# EAGLE design AQS (EAGLE 9.6.2)

## Sheet 1 of 2
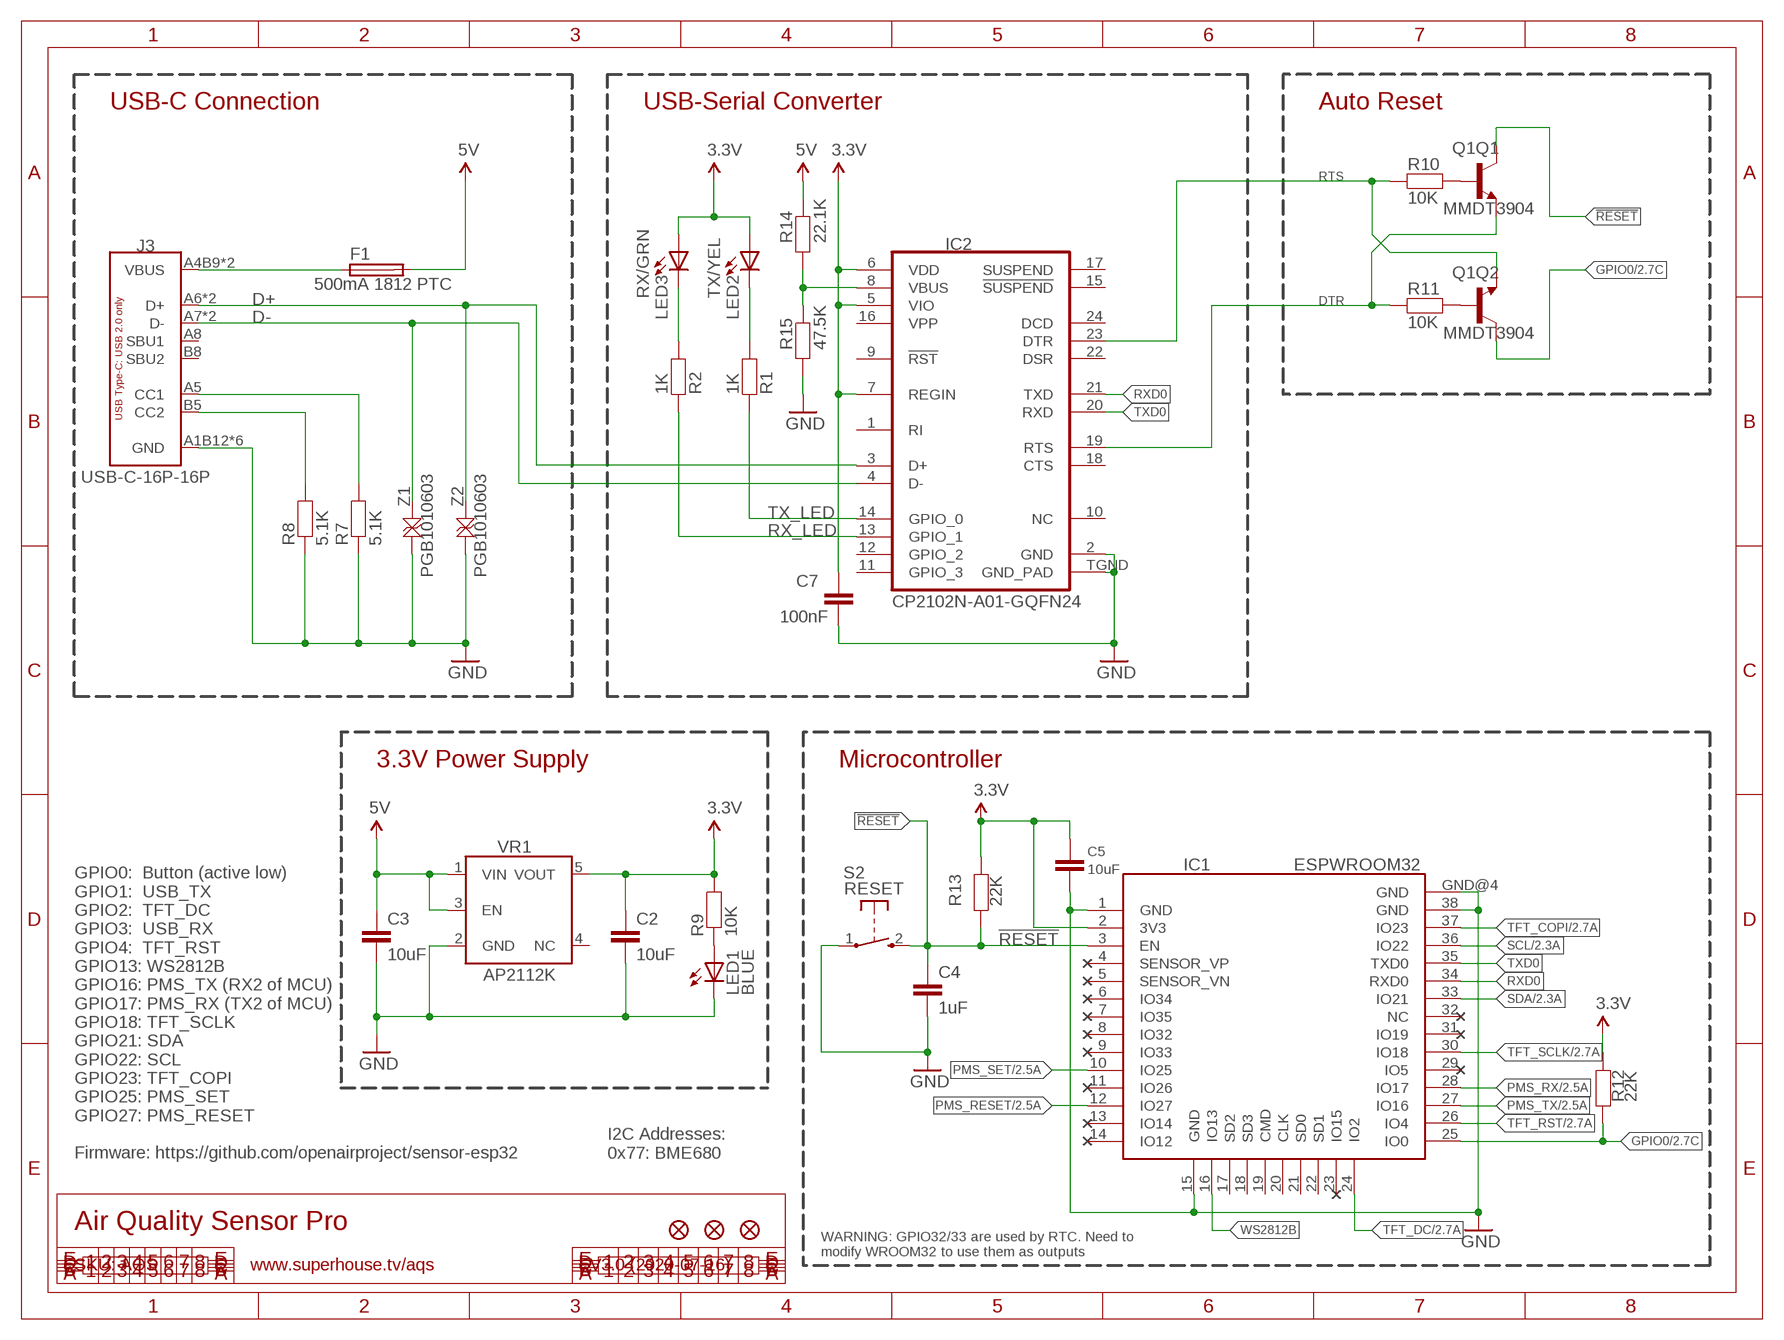
[diagram p0: schematic, sheet 1]

### Parts
C2  10uF  CAP0805  [C0805]
C3  10uF  CAP0805  [C0805]
C4  1uF  CAP0603  [C0603]
C5  10uF  CAP0805  [C0805]
C7  100nF  CAP0603  [C0603]
F1  500mA 1812 PTC  PTC050  [1812]
IC1  ESPWROOM32  [ESPWROOM32]
IC2  CP2102N-A01-GQFN24  CP2104  [QFN-24]
J3  USB-C-16P-16P  [USB-C-16P]
LED1  BLUE  LED0603  [LED-0603]
LED2  TX/YEL  LED0603  [LED-0603]
LED3  RX/GRN  LED0603  [LED-0603]
Q1  MMDT3904  TRANS_NPN_DUAL-MMDT3904  [SOT-363]
R1  1K  RESISTOR0603  [R0603]
R2  1K  RESISTOR0603  [R0603]
R7  5.1K  RESISTOR0603  [R0603]
R8  5.1K  RESISTOR0603  [R0603]
R9  10K  RESISTOR0603  [R0603]
R10  10K  RESISTOR0603  [R0603]
R11  10K  RESISTOR0603  [R0603]
R12  22K  RESISTOR0603  [R0603]
R13  22K  RESISTOR0603  [R0603]
R14  22.1K  RESISTOR0603  [R0603]
R15  47.5K  RESISTOR0603  [R0603]
S2  RESET  TAC_SWITCH_2PINSMT  [TACTILE_SMT_3X4X2]
U$23  FIDUCIAL1X2  [FIDUCIAL-1X2]
U$24  FIDUCIAL1X2  [FIDUCIAL-1X2]
U$25  FIDUCIAL1X2  [FIDUCIAL-1X2]
VR1  AP2112KSOT25  [SOT23-5]
Z1  PGB1010603  TVS0603  [TVS0603]
Z2  PGB1010603  TVS0603  [TVS0603]

### Nets
3.3V: C2.1 C5.1 C7.1 IC1.2(3V3) IC2.5(VIO) IC2.6(VDD) IC2.7(REGIN) LED2.A LED3.A R9.2 R12.1 R13.1 VR1.5(VOUT) ; also sheet 2
5V: C3.1 F1.2 R14.2 VR1.1(VIN) VR1.3(EN) ; also sheet 2
!RESET: C4.1 IC1.3(EN) Q1.3(Q1:C) R13.2 S2.2(S)
D+: IC2.3(D+) J3.A6(D+) J3.B6(D+) Z2.2
D-: IC2.4(D-) J3.A7(D-) J3.B7(D-) Z1.2
DTR: IC2.23(DTR) Q1.1(Q2:E) R10.1
GND: C2.2 C3.2 C4.2 C5.2 C7.2 IC1.1(GND) IC1.15(GND) IC1.38(GND) IC1.GND@4(GND) IC2.2(GND) IC2.TGND(GND_PAD) J3.A1B12(GND) J3.A12B1(GND) J3.FIX1(GND) J3.FIX2(GND) J3.FIX3(GND) J3.FIX4(GND) LED1.C R7.1 R8.1 R15.1 S2.1(P) VR1.2(GND) Z1.1 Z2.1 ; also sheet 2
GPIO0: IC1.25(IO0) Q1.6(Q2:C) R12.2 ; also sheet 2
N$1: LED1.A R9.1
N$2: LED3.C R2.2
N$7: Q1.5(Q1:B) R10.2
N$8: Q1.2(Q2:B) R11.2
N$10: J3.B5(CC2) R8.2
N$11: J3.A5(CC1) R7.2
N$13: LED2.C R1.2
N$39: IC2.8(VBUS) R14.1 R15.2
PMS_RESET: IC1.12(IO27) ; also sheet 2
PMS_RX: IC1.28(IO17) ; also sheet 2
PMS_SET: IC1.10(IO25) ; also sheet 2
PMS_TX: IC1.27(IO16) ; also sheet 2
RTS: IC2.19(RTS) Q1.4(Q1:E) R11.1
RX_LED: IC2.13(GPIO_1) R2.1
RXD0: IC1.34(RXD0) IC2.21(TXD)
SCL: IC1.36(IO22) ; also sheet 2
SDA: IC1.33(IO21) ; also sheet 2
TFT_COPI: IC1.37(IO23) ; also sheet 2
TFT_DC: IC1.24(IO2) ; also sheet 2
TFT_RST: IC1.26(IO4) ; also sheet 2
TFT_SCLK: IC1.30(IO18) ; also sheet 2
TX_LED: IC2.14(GPIO_0) R1.1
TXD0: IC1.35(TXD0) IC2.20(RXD)
VIN: F1.1 J3.A4B9(VBUS) J3.A9B4(VBUS)
WS2812B: IC1.16(IO13)
Unconnected: IC1.4(SENSOR_VP) IC1.5(SENSOR_VN) IC1.6(IO34) IC1.7(IO35) IC1.8(IO32) IC1.9(IO33) IC1.11(IO26) IC1.13(IO14) IC1.14(IO12) IC1.17(SD2) IC1.18(SD3) IC1.19(CMD) IC1.20(CLK) IC1.21(SD0) IC1.22(SD1) IC1.23(IO15) IC1.29(IO5) IC1.31(IO19) IC1.32(NC) IC2.1(RI) IC2.9(!RST) IC2.10(NC) IC2.11(GPIO_3) IC2.12(GPIO_2) IC2.15(!SUSPEND) IC2.16(VPP) IC2.17(SUSPEND) IC2.18(CTS) IC2.22(DSR) IC2.24(DCD) J3.A8(SBU1) J3.B8(SBU2) VR1.4(NC)

### Notes on the sheet
- USB-C Connection | USB-Serial Converter | Auto Reset
- 3.3V Power Supply | Microcontroller
- GPIO0:  Button (active low)
  GPIO1:  USB_TX
  GPIO2:  TFT_DC
  GPIO3:  USB_RX
  GPIO4:  TFT_RST
  GPIO13: WS2812B
  GPIO16: PMS_TX (RX2 of MCU)
  GPIO17: PMS_RX (TX2 of MCU)
  GPIO18: TFT_SCLK
  GPIO21: SDA
  GPIO22: SCL
  GPIO23: TFT_COPI
  GPIO25: PMS_SET
  GPIO27: PMS_RESET
  
  Firmware: https://github.com/openairproject/sensor-esp32
- I2C Addresses:
  0x77: BME680
- Air Quality Sensor Pro
- WARNING: GPIO32/33 are used by RTC. Need to
  modify WROOM32 to use them as outputs
- SKU: AQS | www.superhouse.tv/aqs | V3.0 (2020-07-16)

## Sheet 2 of 2
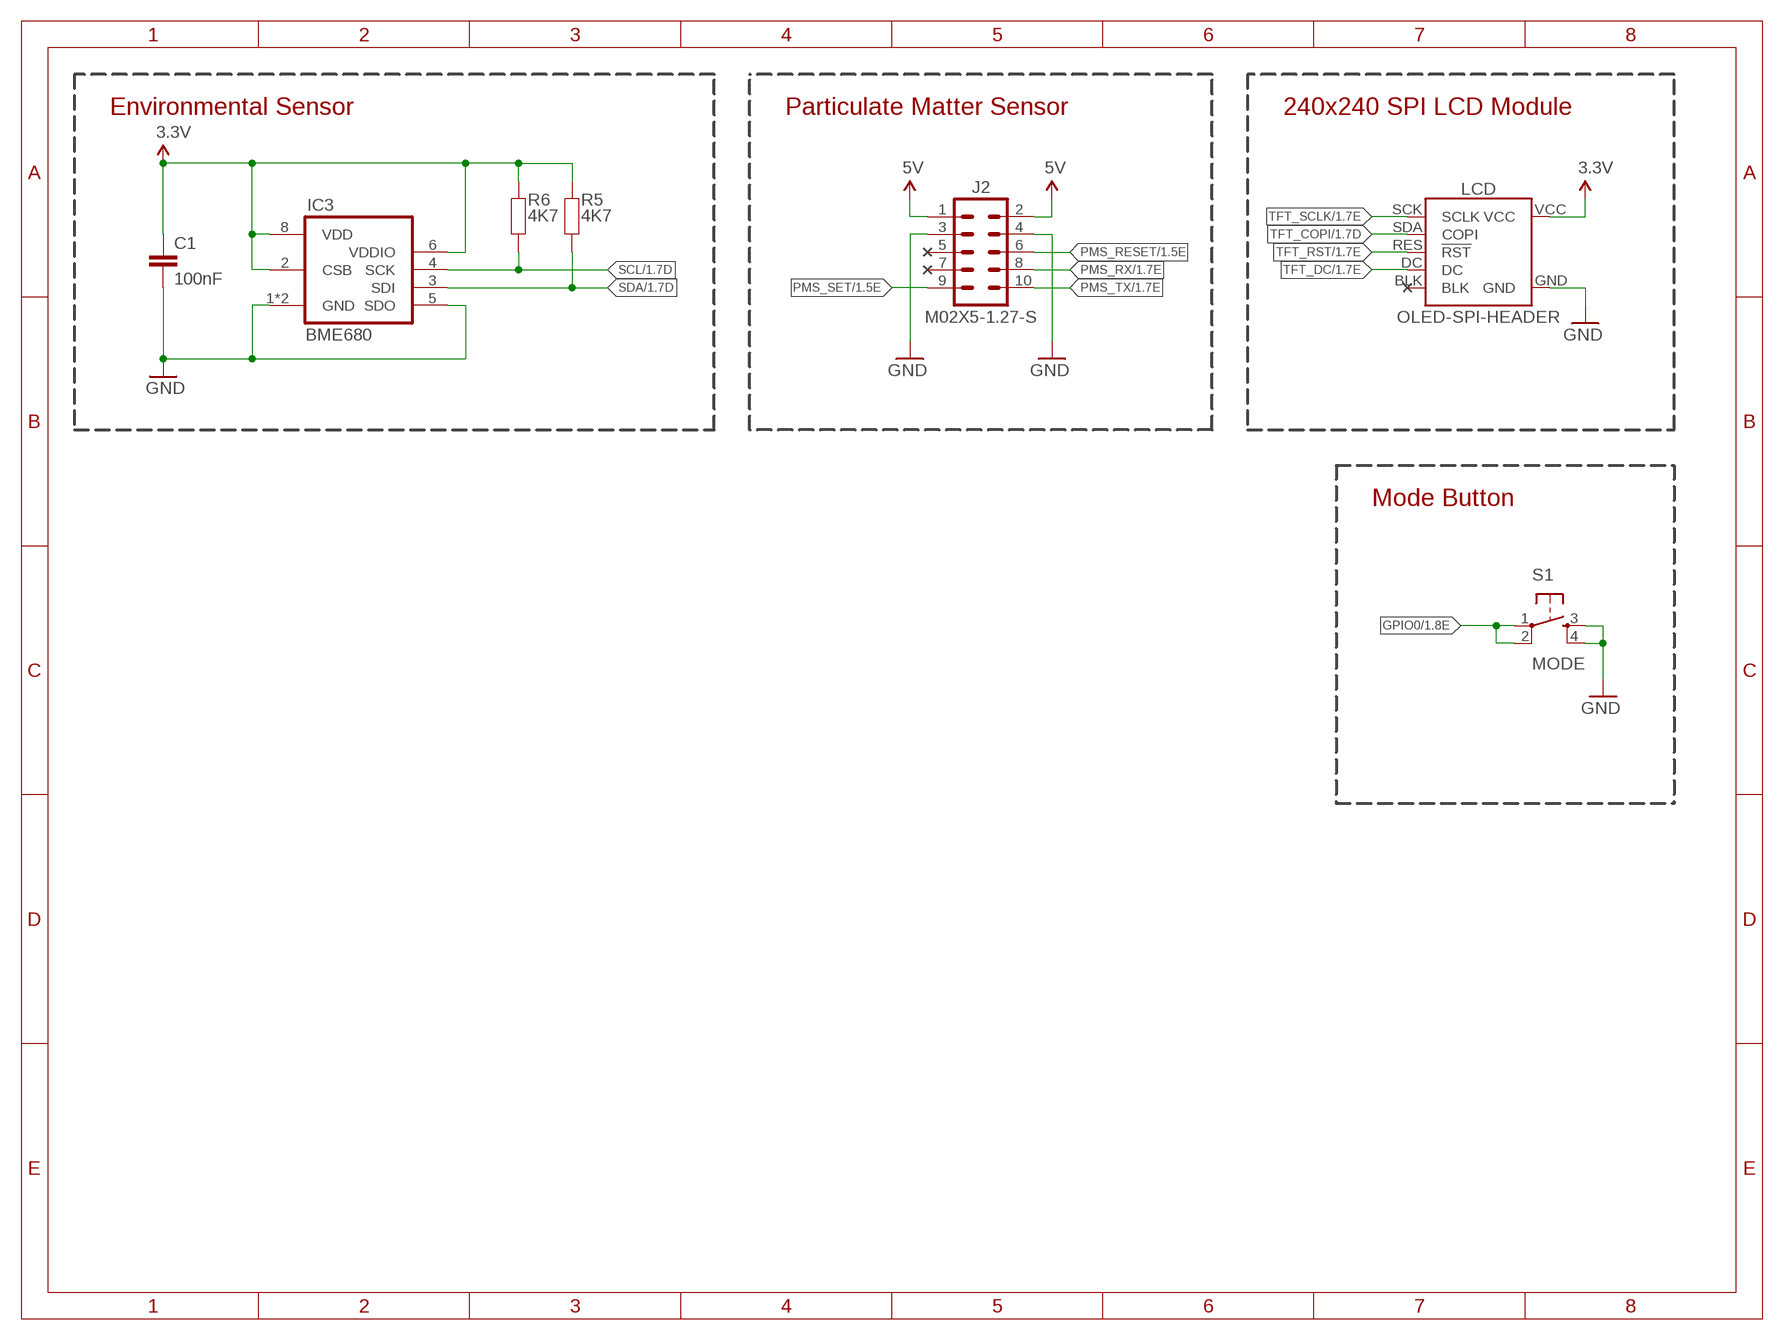
[diagram p1: schematic, sheet 2]

### Parts
C1  100nF  CAP0603  [C0603]
IC3  BME680  [BME680]
J2  M02X5-1.27-S  [2X05-1.27-S]
LCD  OLED-SPI-HEADER  [OLED-240X240-1.3-HEADER]
R5  4K7  RESISTOR0603  [R0603]
R6  4K7  RESISTOR0603  [R0603]
S1  MODE  TAC_SWITCH-PTH-4.5  [TACTILE-PTH-4.5MM]

### Nets
3.3V: C1.1 IC3.2(CSB) IC3.6(VDDIO) IC3.8(VDD) LCD.VCC R5.2 R6.2 ; also sheet 1
5V: J2.1 J2.2 ; also sheet 1
GND: C1.2 IC3.1(GND) IC3.5(SDO) IC3.7(GND) J2.3 J2.4 LCD.GND S1.3 S1.4 ; also sheet 1
GPIO0: S1.1 S1.2 ; also sheet 1
PMS_RESET: J2.6 ; also sheet 1
PMS_RX: J2.8 ; also sheet 1
PMS_SET: J2.9 ; also sheet 1
PMS_TX: J2.10 ; also sheet 1
SCL: IC3.4(SCK) R6.1 ; also sheet 1
SDA: IC3.3(SDI) R5.1 ; also sheet 1
TFT_COPI: LCD.SDA(COPI) ; also sheet 1
TFT_DC: LCD.DC ; also sheet 1
TFT_RST: LCD.RES(!RST) ; also sheet 1
TFT_SCLK: LCD.SCK(SCLK) ; also sheet 1
Unconnected: J2.5 J2.7 LCD.BLK

### Notes on the sheet
- Environmental Sensor | Particulate Matter Sensor | 240x240 SPI LCD Module
- Mode Button

## Library data of the parts
C1-C5 C7 = SuperHouse-DiscreteSemi:CAP: Capacitor Standard ceramic capacitor
F1 = SuperHouse-Fuses:PTC: MF-SMDF Series - PRC Resettable Fuses Source: http://www.farnell.com/datasheets/716597.pdf
IC1 = SuperHouse-MCUs:ESPWROOM32: Espressif WROOM32 ESP32 module
IC2 = SuperHouse-ICs:CP2104: CP2104 / CP2102N-A01-GQFN24 CP2104 USB to serial converter. The CP2104 is not recommended for new designs: replace with CP2102N-A01-GQFN24.
IC3 = SuperHouse-Sensors:BME680: BME680 humdity, pressure, temperature, and gas sensor
J2 = SuperHouse-Connectors:M02X5: M10 header in 2x5 format
J3 = SuperHouse-Connectors:USB-C-16P: USB-C socket with 16 pins, suitable only for backward compatibility with USB 2
LCD = SuperHouse-Displays:OLED-SPI
LED1-LED3 = SuperHouse-LEDs:LED: LEDs Standard schematic elements and footprints for 5mm, 3mm, 1206, and 0603 sized LEDs. 5mm - Spark Fun Electronics SKU : COM-00529 (and others)
Q1 = SuperHouse-DiscreteSemi:TRANS_NPN_DUAL: MMDT3904 Dual 3904 NPN transistors. Datasheet <http://www.onsemi.com/pub_link/Collateral/MBT3904DW1T1-D.PDF>; PROD_ID: TRANS-13337
R1 R2 R5-R15 = SuperHouse-DiscreteSemi:RESISTOR: Resistor Standard resistors.
S1 = SuperHouse-Switches:TAC_SWITCH: Momentary Switch Tactile switch, normally-open.
S2 = SuperHouse-Switches:TAC_SWITCH_2PIN: Momentary Tactile Switch - 2 pin Uxcell 3x4x2mm switch with 2 SMT pads
U$23-U$25 = SuperHouse-Symbols:FIDUCIAL: Fiducial Alignment Points Various fiducial points for machine vision alignment.
VR1 = SuperHouse-Regulators:AP2112K: AP2112K LDO linear voltage regulator
Z1 Z2 = SuperHouse-DiscreteSemi:TVS: TVS voltage protection Zener

## Net classes
0 default: width 0.203 mm, drill 0.356 mm, clearance 0.152 mm
1 power: width 0.203 mm, clearance 0.152 mm

## Board
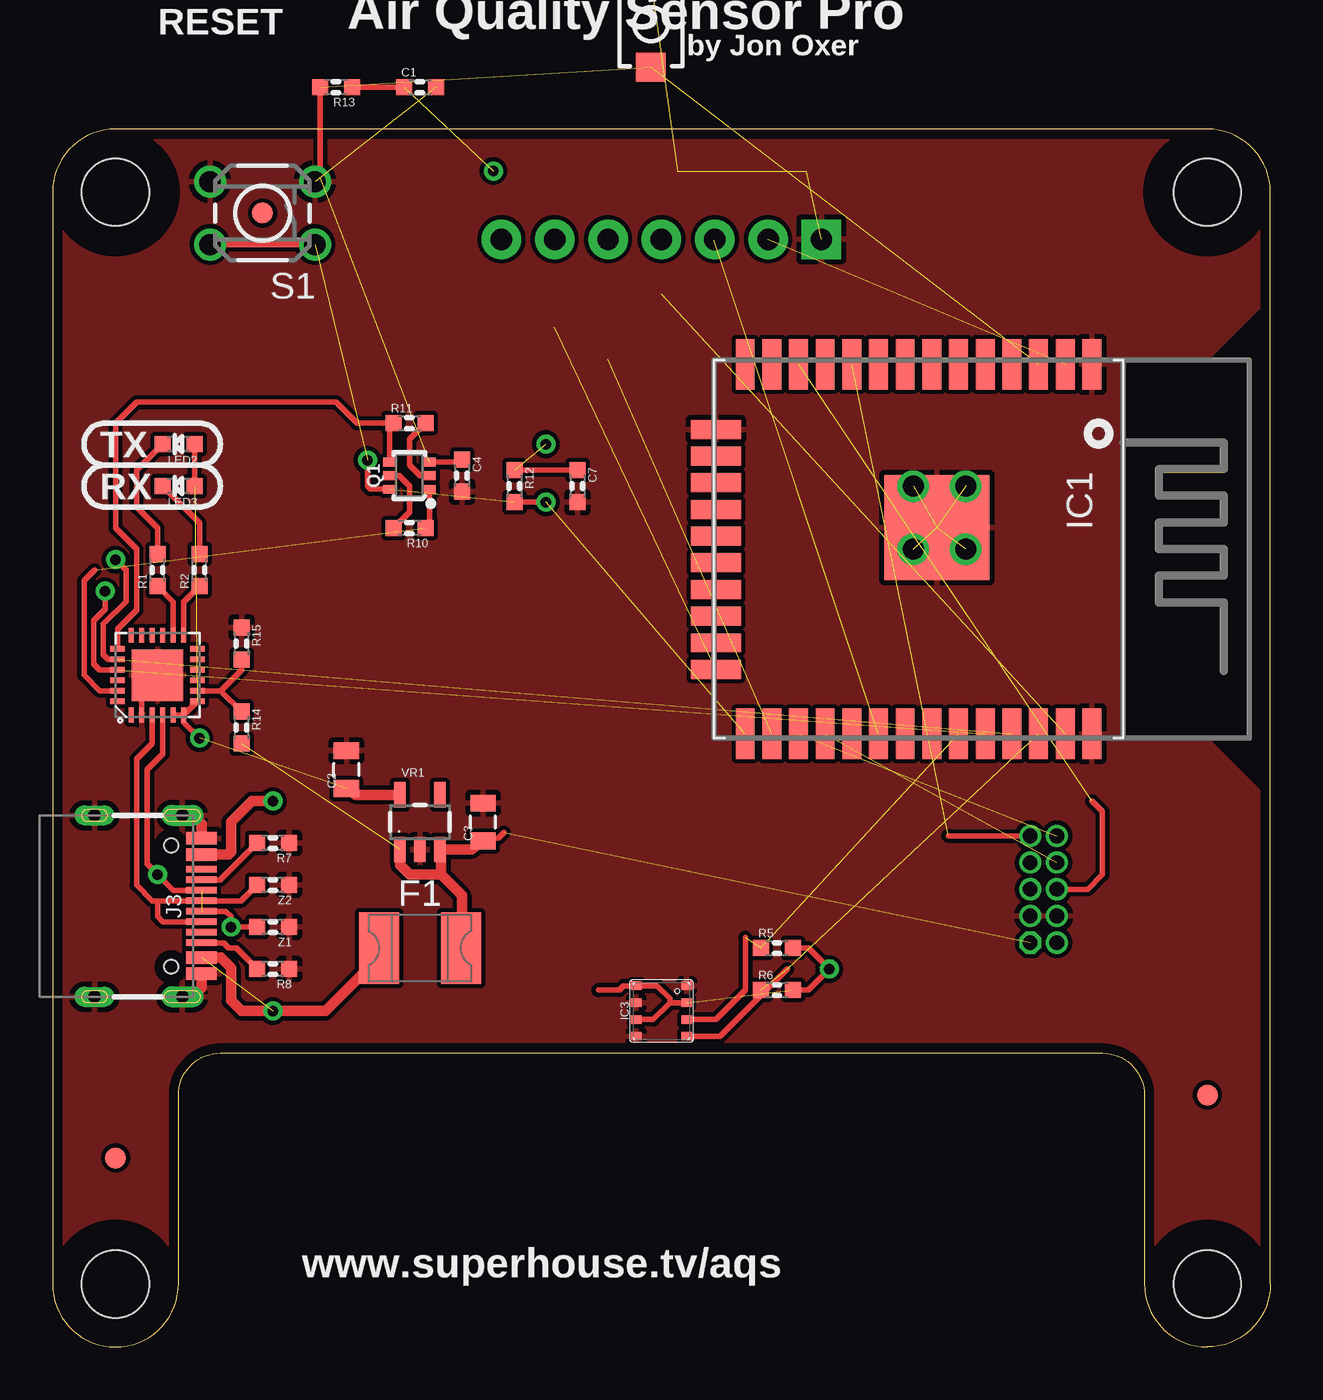
[diagram p2: board, top side]
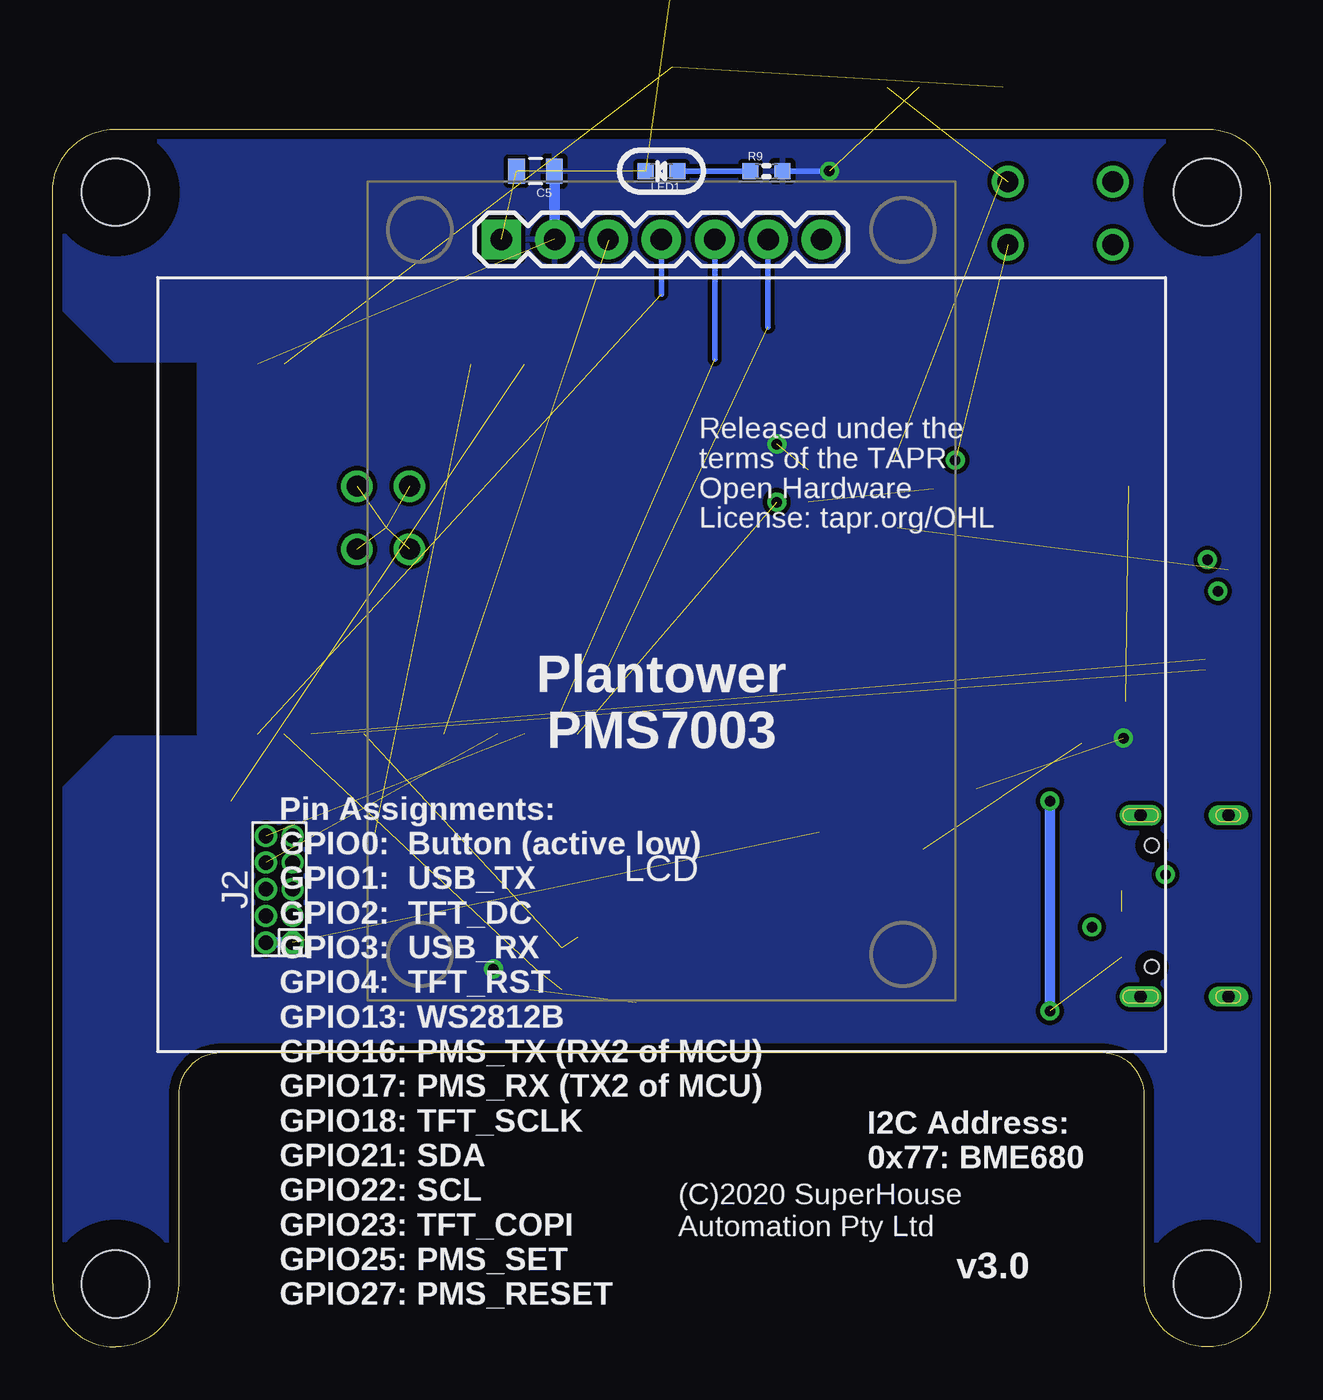
[diagram p3: board, bottom side, seen from below]

Size 58 x 58 mm. Coordinates in mm from the lower left corner, seen from the top.
Outline: 0,55 0,3 arc90 3,0 arc90 6,3 6,12 arc-90 8,14 50,14 arc-90 52,12 52,3 arc90 55,0 arc90 58,3 58,55 arc90 55,58 3,58 arc90 0,55
Copper layers (1*16): Top 0.035mm / dielectric 1.5mm / Bottom 0.035mm
Design rules "SuperHouse-Design-Rules": minimum track width 10mil, minimum drill 24mil, track to track 8mil, track to pad 8mil, pad to pad 8mil, via to via 8mil, smd to smd 6mil, copper to edge 18mil, drill to drill 8mil, minimum pad ring 7mil, minimum via ring 8mil, stop-mask expansion 4mil, vias tented up to drill 0.5mm, thermal gap 10mil
Holes 3.2 mm at 3,55 3,3 55,55 55,3
tRestrict: area 52,0 to 58,6; area 0,52 to 6,58; area 0,0 to 6,6; area 52,52 to 58,58
bRestrict: area 0,52 to 6,58; area 0,0 to 6,6; area 52,0 to 58,6; area 52,52 to 58,58

### Footprints (pad centres in the part's own frame; a part is rotated, then mirrored left to right if it is on the bottom)
C0603 = smd 0.762 x 0.762: 1 -0.762,0; 2 0.762,0
C0805 = smd 0.8 x 1.2: 1 -0.9,0; 2 0.9,0
1812 = smd 1.9 x 3.4: 1 -1.95,0; 2 1.95,0
ESPWROOM32 = smd 2.4 x 0.9: 1 -8.8,-1.5; 2 -8.8,-2.77; 3 -8.8,-4.04; 4 -8.8,-5.31; 5 -8.8,-6.58; 6 -8.8,-7.85; 7 -8.8,-9.12; 8 -8.8,-10.39; 9 -8.8,-11.66; 10 -8.8,-12.93; 11 -8.8,-14.2; 12 -8.8,-15.47; 13 -8.8,-16.74; 14 -8.8,-18.01; 25 8.8,-18.01; 26 8.8,-16.74; 27 8.8,-15.47; 28 8.8,-14.2; 29 8.8,-12.93; 30 8.8,-11.66; 31 8.8,-10.39; 32 8.8,-9.12; 33 8.8,-7.85; 34 8.8,-6.58; 35 8.8,-5.31; 36 8.8,-4.04; 37 8.8,-2.77; 38 8.8,-1.5 | smd 0.9 x 2.4: 15 -5.7,-19.4; 16 -4.43,-19.4; 17 -3.16,-19.4; 18 -1.89,-19.4; 19 -0.62,-19.4; 20 0.65,-19.4; 21 1.92,-19.4; 22 3.19,-19.4; 23 4.46,-19.4; 24 5.73,-19.4 | smd 5 x 5: GND@4 -1.03,-8.89
QFN-24 = smd 0.25 x 0.7: 1 -1.25,-1.9; 2 -0.75,-1.9; 3 -0.25,-1.9; 4 0.25,-1.9; 5 0.75,-1.9; 6 1.25,-1.9; 13 1.25,1.9; 14 0.75,1.9; 15 0.25,1.9; 16 -0.25,1.9; 17 -0.75,1.9; 18 -1.25,1.9 | smd 0.7 x 0.25: 7 1.9,-1.25; 8 1.9,-0.75; 9 1.9,-0.25; 10 1.9,0.25; 11 1.9,0.75; 12 1.9,1.25; 19 -1.9,1.25; 20 -1.9,0.75; 21 -1.9,0.25; 22 -1.9,-0.25; 23 -1.9,-0.75; 24 -1.9,-1.25 | smd 2.45 x 2.45: TGND 0,0
BME680 = smd 0.4 x 0.5: 1 1.2,-1.2; 2 0.4,-1.2; 3 -0.4,-1.2; 4 -1.2,-1.2; 5 -1.2,1.2; 6 -0.4,1.2; 7 0.4,1.2; 8 1.2,1.2
2X05-1.27-S = drill 0.7 pad 1.016 octagon: 1 -2.54,-0.635 | drill 0.7 pad 1.016: 2 -2.54,0.635; 3 -1.27,-0.635; 4 -1.27,0.635; 5 0,-0.635; 6 0,0.635; 7 1.27,-0.635; 8 1.27,0.635; 9 2.54,-0.635; 10 2.54,0.635
USB-C-16P = smd 0.6 x 1.45: A1B12 -3.225,5.095; A4B9 -2.45,5.095; A9B4 2.45,5.095; A12B1 3.225,5.095 | smd 0.3 x 1.45: A5 -1.25,5.095; A6 -0.25,5.095; A7 0.25,5.095; A8 1.25,5.095; B5 1.75,5.095; B6 0.75,5.095; B7 -0.75,5.095; B8 -1.75,5.095 | drill 0.6 pad 0.8 long: FIX1 -4.32,0; FIX4 4.32,0 | drill 0.6 pad 1 long: FIX2 -4.32,4.18; FIX3 4.32,4.18 | hole 0.65: 2.89,3.65; -2.89,3.65
OLED-240X240-1.3-HEADER = drill 1.016 pad 1.88: BLK 7.62,14.75; DC 5.08,14.75; RES 2.54,14.75; SCK -2.54,14.75; SDA 0,14.75; VCC -5.08,14.75 | drill 1.016 pad 1.88 square: GND -7.62,14.75
LED-0603 = smd 0.762 x 0.762: A -0.762,0; C 0.762,0
SOT-363 = smd 0.42 x 0.6: 1 -0.65,-0.95; 2 0,-0.95; 3 0.65,-0.95; 4 0.65,0.95; 5 0,0.95; 6 -0.65,0.95
R0603 = smd 0.762 x 0.762: 1 -0.762,0; 2 0.762,0
TACTILE-PTH-4.5MM = drill 1.016: 1 -2.5,1.5; 2 2.5,1.5; 3 -2.5,-1.5; 4 2.5,-1.5
TACTILE_SMT_3X4X2 = smd 1.4 x 1.4: 1 -2.05,0; 2 2.05,0
FIDUCIAL-1X2 = smd 1 x 1: 1 0,0
SOT23-5 = smd 0.55 x 1.2: 1 -0.95,-1.3; 2 0,-1.3; 3 0.95,-1.3; 4 0.95,1.3; 5 -0.95,1.3
TVS0603 = smd 0.762 x 0.762: 1 -0.762,0; 2 0.762,0

### Placement (x,y rotation side)
C1  17.5,60 0 top
C2  14,27.5 90 top
C3  20.5,25 90 top
C4  19.5,41.5 270 top
C5  35,56 180 bottom
C7  25,41 270 top
F1  17.5,19 0 top
IC1  51,38 270 top
IC2  5,32 0 top
IC3  29,16 90 top
J2  47.2,21.8 90 bottom
J3  2,21 270 top
LCD  29,38 0 bottom
LED1  29,56 180 bottom
LED2  6,43 180 top
LED3  6,41 180 top
Q1  17,41.5 90 top
R1  5,37 90 top
R2  7,37 90 top
R5  34.5,19 0 top
R6  34.5,17 0 top
R7  10.5,24 180 top
R8  10.5,18 180 top
R9  24,56 0 bottom
R10  17,39 180 top
R11  17,44 0 top
R12  22,41 270 top
R13  13.5,60 180 top
R14  9,29.5 270 top
R15  9,33.5 270 top
S1  10,54 180 top
S2  28.5,63 270 top
U$23  10,54 0 top
U$24  55,12 0 top
U$25  3,9 0 top
VR1  17.5,25 0 top
Z1  10.5,20 180 top
Z2  10.5,22 180 top

### Tracks (layer width: path | path; a pad name or v marks a point on that pad's centre or on a via)
3.3V  (via drill 0.5)  (6 unrouted)
  Top 0.254: IC3.6 28.6,15.6 29.4,16.4 | IC3.2 29.4,16.4 | 29.4,16.4 29.4,16.6 28.8,17.2 IC3.8 27.2,17.2 27,17 26,17 | C1.1 R13.1 | R6.2 36,17 v37,18 36,19 R5.2 | LED3.A LED2.A | C7.1 R12.1 | IC2.5 IC2.6 | IC2.6 IC2.7 | IC2.6 6.25,29.75 v7,29
  Top 0.508: C2.1 14.44,26.3 VR1.5
  Bottom 0.254: R9.2 v21,56
  Bottom 0.508: C5.1 34.1,52.77 LCD.VCC
  other vias: 23.5,43
  pour Bottom: 0,55 arc-90 3,58 55,58 arc-90 58,55 58,50 55,47 51,47 51,29 55,29 58,26 58,3 arc-90 55,0 arc-90 52,3 52,12 arc90 50,14 8,14 arc90 6,12 6,3 arc-90 3,0 arc-90 0,3
5V  (2 unrouted)
  Top 0.254: C3.1 21.24,24.24 21.5,24.5
  Top 0.508: 18.5,22.5 18.5,23.65 VR1.3 19.96,23.7 C3.1 | 18.5,22.5 19.5,21.5 19.5,19.05 F1.2 | 18.5,22.5 17,22.5 16.55,22.95 VR1.1
  Bottom 0.508: J2.2 J2.1
!RESET  (3 unrouted)
  Top 0.254: Q1.3 19.39,42.15 C4.1 | R13.2 12.74,55.71
D+
  Top 0.254: Z2.2 8.99,21.25 J3.A6 5,21.25 | J3.B6 5.25,20.25 5,20.5 5,21.25 | 5,21.25 4.75,21.25 4,22 4,28 4.75,28.75 IC2.3
D-  (via drill 0.5)  (1 unrouted)
  Top 0.254: Z1.2 v8.5,20 8.5,20.5 8.25,20.75 J3.A7 | J3.B7 5.75,21.75 v5,22.5 4.5,23 4.5,27.5 5.25,28.25 IC2.4
DTR  (1 unrouted)
  Top 0.254: Q1.1 17.95,39.19 17.88,39.12 | 17.88,39.12 R10.1 | 17.88,39.12 18,39 | IC2.23 2.25,31.25 1.5,32 1.5,36.5 2,37
GND  (via drill 1)  (8 unrouted)
  Top 0.254: IC2.2 4.25,31.25 IC2.TGND
  Top 0.508: J3.A12B1 7.09,17.09 6.68,16.68 J3.FIX3 | J3.FIX2 6.68,25.32 7.09,24.91 J3.A1B12
  other vias: 41,38 43.5,38 41,41 43.5,41
  pour Top: 0,3 0,55 arc-90 3,58 55,58 arc-90 58,55 58,50 55,47 51,47 51,29 55,29 58,26 58,3 arc-90 55,0 arc-90 52,3 52,12 arc90 50,14 8,14 arc90 6,12 6,3 arc-90 3,0 arc-90
GPIO0  (via drill 0.5)  (3 unrouted)
  Top 0.254: S1.1 S1.2 | R12.2 v23.5,40.24 | Q1.6 15.15,40.85 15,41 v15,42.24
N$1
  Bottom 0.254: R9.1 LED1.A
N$2
  Top 0.254: R2.2 7,39.24 LED3.C
N$7
  Top 0.254: Q1.5 16.5,41.5 17,41 17,39.76 R10.2
N$8
  Top 0.254: Q1.2 17.5,41.5 17,42 17,43.24 R11.2
N$10
  Top 0.254: R8.2 8.74,19 8.39,19 8.14,19.25 J3.B5
N$11
  Top 0.254: J3.A5 7.99,22.25 R7.2
N$13
  Top 0.254: R1.2 5,39 4,40 4,41.76 LED2.C
N$39
  Top 0.254: IC2.8 8.01,31.25 | 8.01,31.25 R14.1 | R15.2 9,32.24 8.01,31.25
PMS_RESET  (1 unrouted)
  Top 0.254: 49.5,26 50,25.5 50,22.5 49.3,21.8 J2.6
PMS_RX  (1 unrouted)
PMS_SET  (1 unrouted)
  Top 0.254: 42.66,24.34 J2.9
PMS_TX  (1 unrouted)
RTS
  Top 0.254: Q1.4 16.05,43.81 R11.1 14.5,44 13.5,45 4,45 3,44 3,39 4,38 4,35.09 3.1,34.19 IC2.19
RX_LED
  Top 0.254: IC2.13 6.25,35.49 R2.1
RXD0  (via drill 0.5)  (1 unrouted)
  Top 0.254: IC2.21 2.25,32.25 1.96,32.54 1.96,34.61 2.5,35.15 v2.5,36
SCL  (2 unrouted)
  Top 0.254: 35,18 31.8,14.8 IC3.4
SDA  (2 unrouted)
  Top 0.254: 33,19.5 33,17 31.6,15.6 IC3.3
TFT_COPI  (1 unrouted)
  Bottom 0.254: 29,50.15 LCD.SDA
TFT_DC  (1 unrouted)
  Bottom 0.254: 23.92,48.58 LCD.DC
TFT_RST  (1 unrouted)
  Bottom 0.254: 26.46,47.04 LCD.RES
TFT_SCLK  (1 unrouted)
  Top 0.254: LCD.SCK 31.5,52.71
TX_LED
  Top 0.254: IC2.14 5.75,35.49 R1.1
TXD0  (via drill 0.5)  (1 unrouted)
  Top 0.254: IC2.20 2.66,32.75 2.42,32.99 2.42,34.42 3.5,35.5 3.5,37 v3,37.5
VIN  (via drill 0.5)  (1 unrouted)
  Top 0.508: v10.5,26 9.5,26 8.5,25 8.5,23.59 8.38,23.47 7.11,23.47 J3.A4B9 | J3.A9B4 8,18.55 8.5,18.05 8.5,16.5 9,16 13,16 15,18 15,18.5 15.5,19 F1.1 | F1.1 15.5,19.05 | 15.5,20 15.55,19.95 F1.1
  Bottom 0.508: v10.5,26 v10.5,16

### Text on the board
tPlace: Super / House | Air Quality Sensor Pro | RESET | by Jon Oxer | TX | RX | www.superhouse.tv/aqs
bPlace: Released under the / terms of the TAPR / Open Hardware / License: tapr.org/OHL | Plantower / PMS7003 | I2C Address: / 0x77: BME680 | (C)2020 SuperHouse / Automation Pty Ltd | v3.0 | Pin Assignments: / GPIO0: Button (active low) / GPIO1: USB_TX / GPIO2: TFT_DC / GPIO3: USB_RX / GPIO4: TFT_RST / GPIO13: WS2812B / GPIO16: PMS_TX (RX2 of MCU) / GPIO17: PMS_RX (TX2 of MCU) / GPIO18: TFT_SCLK / GPIO21: SDA / GPIO22: SCL / GPIO23: TFT_COPI / GPIO25: PMS_SET / GPIO27: PMS_RESET